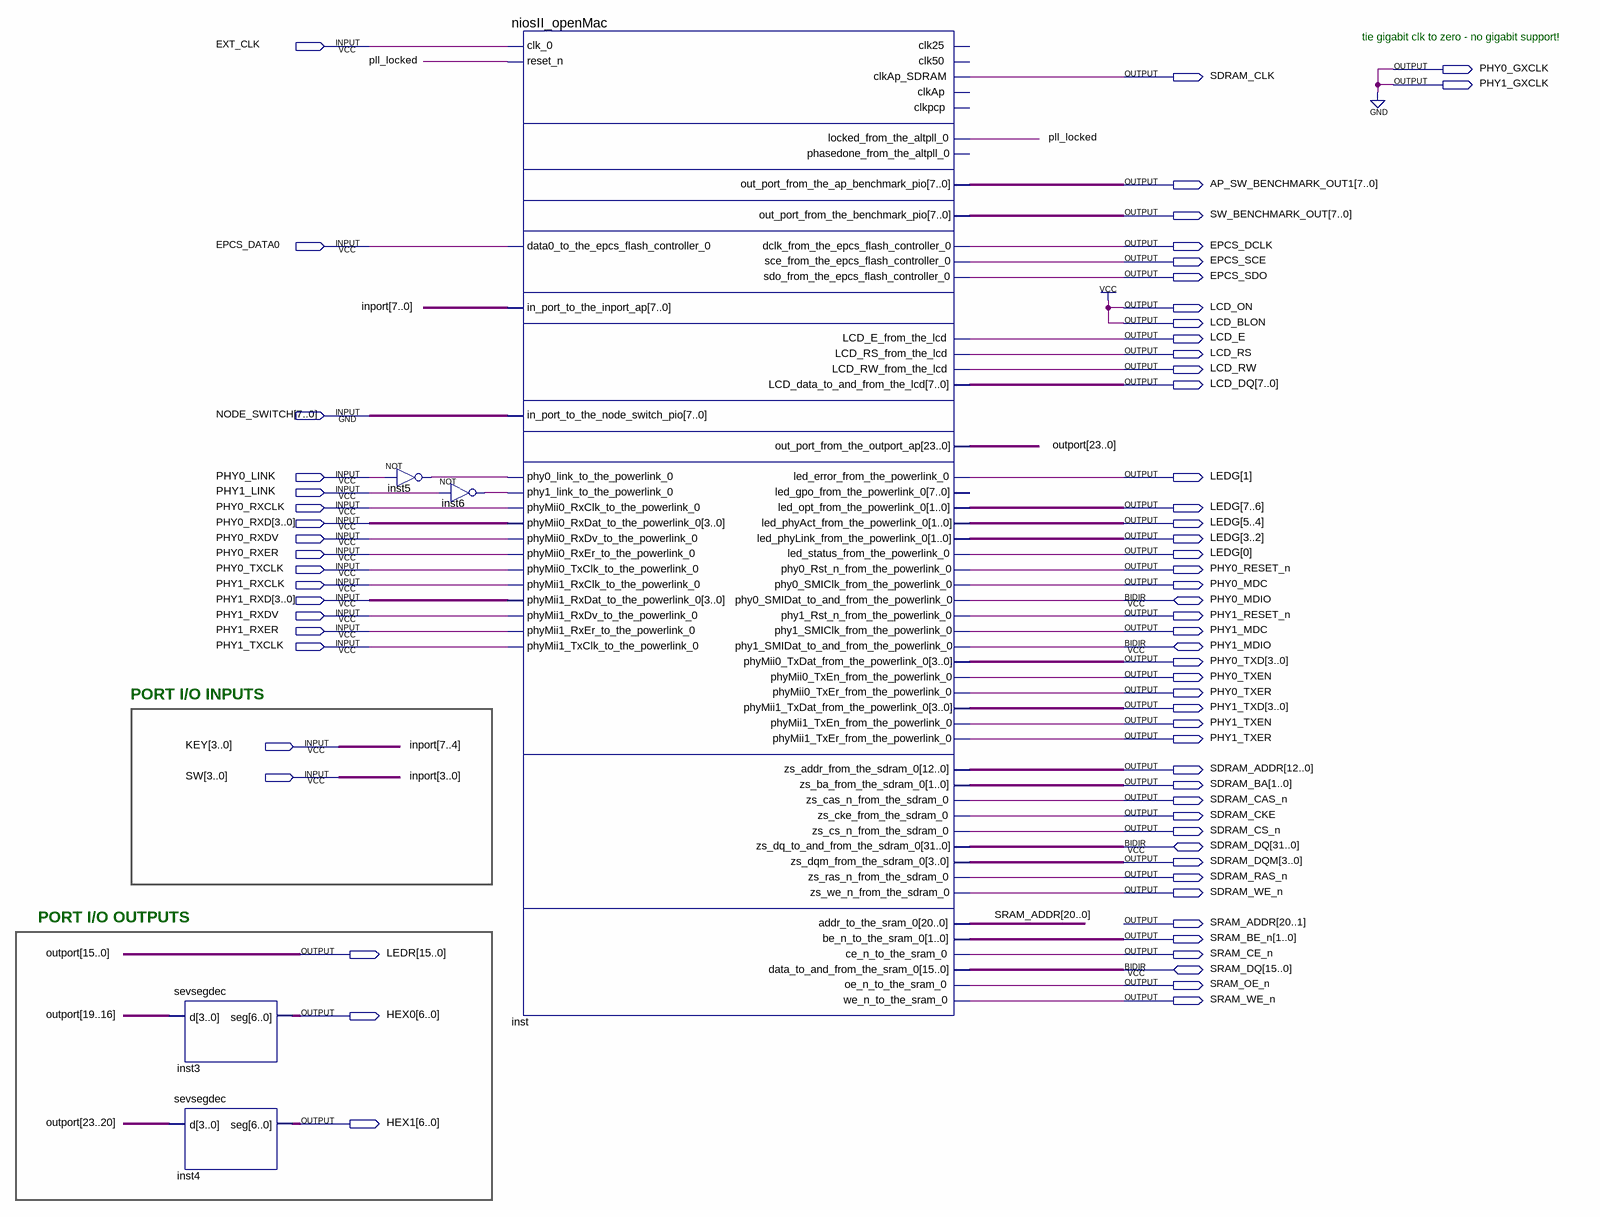
[diagram p0: schematic sheet]
// Quartus schematic nios_pll.bdf as structural Verilog: 5 symbols, 66 pins
module nios_pll (
  input  EXT_CLK,
  input  EPCS_DATA0,
  input  [7:0] NODE_SWITCH,
  input  PHY0_LINK,
  input  PHY1_LINK,
  input  PHY0_RXCLK,
  input  [3:0] PHY0_RXD,
  input  PHY0_RXDV,
  input  PHY0_RXER,
  input  PHY0_TXCLK,
  input  PHY1_RXCLK,
  input  [3:0] PHY1_RXD,
  input  PHY1_RXDV,
  input  PHY1_RXER,
  input  PHY1_TXCLK,
  input  [3:0] KEY,
  input  [3:0] SW,
  inout  PHY0_MDIO,
  inout  PHY1_MDIO,
  inout  [31:0] SDRAM_DQ,
  inout  [15:0] SRAM_DQ,
  output PHY0_GXCLK,
  output SDRAM_CLK,
  output PHY1_GXCLK,
  output [7:0] AP_SW_BENCHMARK_OUT1,
  output [7:0] SW_BENCHMARK_OUT,
  output EPCS_DCLK,
  output EPCS_SCE,
  output EPCS_SDO,
  output LCD_ON,
  output LCD_BLON,
  output LCD_E,
  output LCD_RS,
  output LCD_RW,
  output [7:0] LCD_DQ,
  output [7:0] LEDG,
  output PHY0_RESET_n,
  output PHY0_MDC,
  output PHY1_RESET_n,
  output PHY1_MDC,
  output [3:0] PHY0_TXD,
  output PHY0_TXEN,
  output PHY0_TXER,
  output [3:0] PHY1_TXD,
  output PHY1_TXEN,
  output PHY1_TXER,
  output [12:0] SDRAM_ADDR,
  output [1:0] SDRAM_BA,
  output SDRAM_CAS_n,
  output SDRAM_CKE,
  output SDRAM_CS_n,
  output [3:0] SDRAM_DQM,
  output SDRAM_RAS_n,
  output SDRAM_WE_n,
  output [20:0] SRAM_ADDR,
  output [1:0] SRAM_BE_n,
  output [15:0] LEDR,
  output SRAM_CE_n,
  output SRAM_OE_n,
  output SRAM_WE_n,
  output [6:0] HEX0,
  output [6:0] HEX1
);

  wire inst5_out, inst6_out, pll_locked;
  wire [23:16] outport;

  sevsegdec inst3 (.d(outport[19:16]), .seg(HEX0));
  sevsegdec inst4 (.d(outport[23:20]), .seg(HEX1));
  not inst5 (inst5_out, PHY0_LINK);
  not inst6 (inst6_out, PHY1_LINK);
  niosII_openMac inst (
    .clk_0(EXT_CLK), .reset_n(pll_locked), .data0_to_the_epcs_flash_controller_0(EPCS_DATA0),
    .in_port_to_the_inport_ap({KEY, SW}), .in_port_to_the_node_switch_pio(NODE_SWITCH),
    .phy0_link_to_the_powerlink_0(inst5_out), .phy1_link_to_the_powerlink_0(inst6_out),
    .phyMii0_RxClk_to_the_powerlink_0(PHY0_RXCLK), .phyMii0_RxDat_to_the_powerlink_0(PHY0_RXD),
    .phyMii0_RxDv_to_the_powerlink_0(PHY0_RXDV), .phyMii0_RxEr_to_the_powerlink_0(PHY0_RXER),
    .phyMii0_TxClk_to_the_powerlink_0(PHY0_TXCLK), .phyMii1_RxClk_to_the_powerlink_0(PHY1_RXCLK),
    .phyMii1_RxDat_to_the_powerlink_0(PHY1_RXD), .phyMii1_RxDv_to_the_powerlink_0(PHY1_RXDV),
    .phyMii1_RxEr_to_the_powerlink_0(PHY1_RXER), .phyMii1_TxClk_to_the_powerlink_0(PHY1_TXCLK),
    .clkAp_SDRAM(SDRAM_CLK), .locked_from_the_altpll_0(pll_locked),
    .out_port_from_the_ap_benchmark_pio(AP_SW_BENCHMARK_OUT1),
    .out_port_from_the_benchmark_pio(SW_BENCHMARK_OUT), .dclk_from_the_epcs_flash_controller_0(EPCS_DCLK),
    .sce_from_the_epcs_flash_controller_0(EPCS_SCE), .sdo_from_the_epcs_flash_controller_0(EPCS_SDO),
    .LCD_E_from_the_lcd(LCD_E), .LCD_RS_from_the_lcd(LCD_RS), .LCD_RW_from_the_lcd(LCD_RW),
    .out_port_from_the_outport_ap({outport, LEDR}), .led_error_from_the_powerlink_0(LEDG[1]),
    .led_opt_from_the_powerlink_0(LEDG[7:6]), .led_phyAct_from_the_powerlink_0(LEDG[5:4]),
    .led_phyLink_from_the_powerlink_0(LEDG[3:2]), .led_status_from_the_powerlink_0(LEDG[0]),
    .phy0_Rst_n_from_the_powerlink_0(PHY0_RESET_n), .phy0_SMIClk_from_the_powerlink_0(PHY0_MDC),
    .phy1_Rst_n_from_the_powerlink_0(PHY1_RESET_n), .phy1_SMIClk_from_the_powerlink_0(PHY1_MDC),
    .phyMii0_TxDat_from_the_powerlink_0(PHY0_TXD), .phyMii0_TxEn_from_the_powerlink_0(PHY0_TXEN),
    .phyMii0_TxEr_from_the_powerlink_0(PHY0_TXER), .phyMii1_TxDat_from_the_powerlink_0(PHY1_TXD),
    .phyMii1_TxEn_from_the_powerlink_0(PHY1_TXEN), .phyMii1_TxEr_from_the_powerlink_0(PHY1_TXER),
    .zs_addr_from_the_sdram_0(SDRAM_ADDR), .zs_ba_from_the_sdram_0(SDRAM_BA),
    .zs_cas_n_from_the_sdram_0(SDRAM_CAS_n), .zs_cke_from_the_sdram_0(SDRAM_CKE),
    .zs_cs_n_from_the_sdram_0(SDRAM_CS_n), .zs_dqm_from_the_sdram_0(SDRAM_DQM),
    .zs_ras_n_from_the_sdram_0(SDRAM_RAS_n), .zs_we_n_from_the_sdram_0(SDRAM_WE_n),
    .addr_to_the_sram_0(SRAM_ADDR), .be_n_to_the_sram_0(SRAM_BE_n), .ce_n_to_the_sram_0(SRAM_CE_n),
    .oe_n_to_the_sram_0(SRAM_OE_n), .we_n_to_the_sram_0(SRAM_WE_n), .LCD_data_to_and_from_the_lcd(LCD_DQ),
    .phy0_SMIDat_to_and_from_the_powerlink_0(PHY0_MDIO), .phy1_SMIDat_to_and_from_the_powerlink_0(PHY1_MDIO),
    .zs_dq_to_and_from_the_sdram_0(SDRAM_DQ), .data_to_and_from_the_sram_0(SRAM_DQ));  // open: clk25, clk50, clkAp, clkpcp, phasedone_from_the_altpll_0, led_gpo_from_the_powerlink_0

  assign LCD_BLON = 1'b1;
  assign LCD_ON = 1'b1;
  assign PHY0_GXCLK = 1'b0;
  assign PHY1_GXCLK = 1'b0;

  // Other names for the same wires on the sheet: inport[7:0] = {KEY, SW}; outport[15:0] = LEDR

  // Notes on the sheet:
  //   tie gigabit clk to zero - no gigabit support!
  //   PORT I/O INPUTS
  //   PORT I/O OUTPUTS
endmodule
